# EasyEDA schematic SCH_OPLL-AMP-FMPAC-5V_2023-11-02.json

## Sheets
1 AMP: TITLE: Sheet_1; REV: 1.0; Date: 2023-11-02; Sheet: 1/1; Drawn By: Denjhang; Company: Your Company
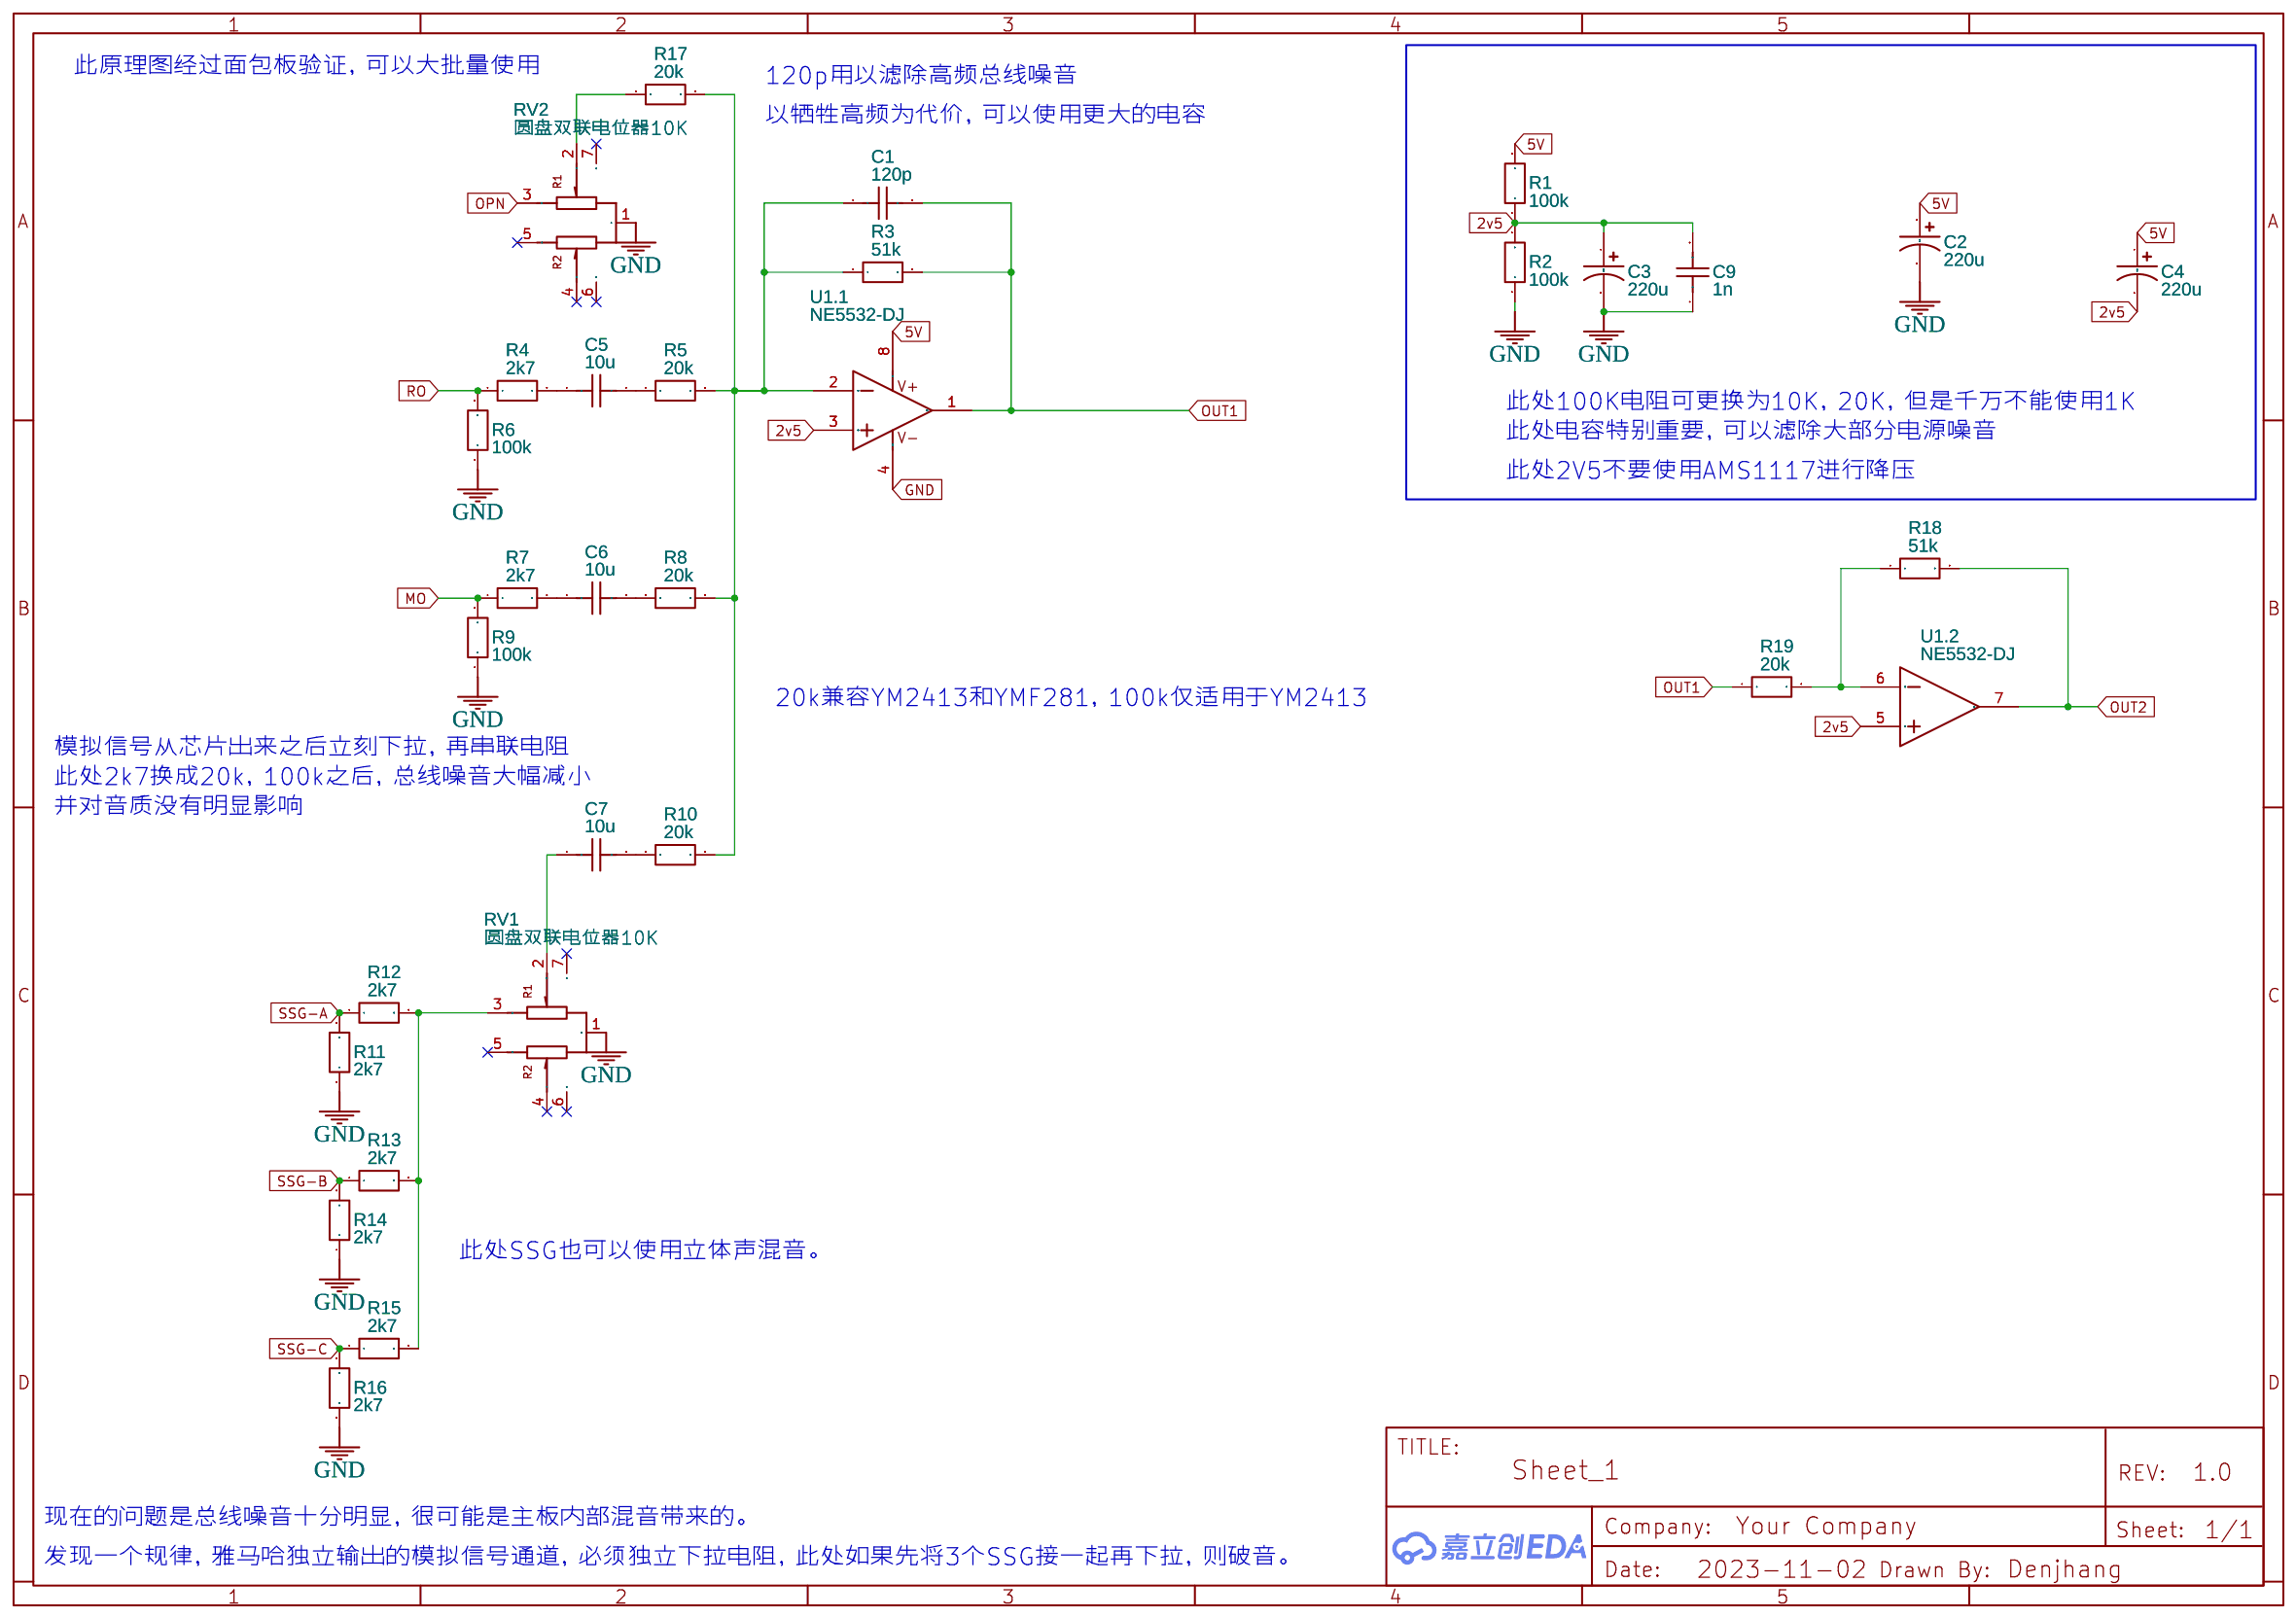
[diagram p0: AMP]
2 BUS: TITLE: Sheet_2
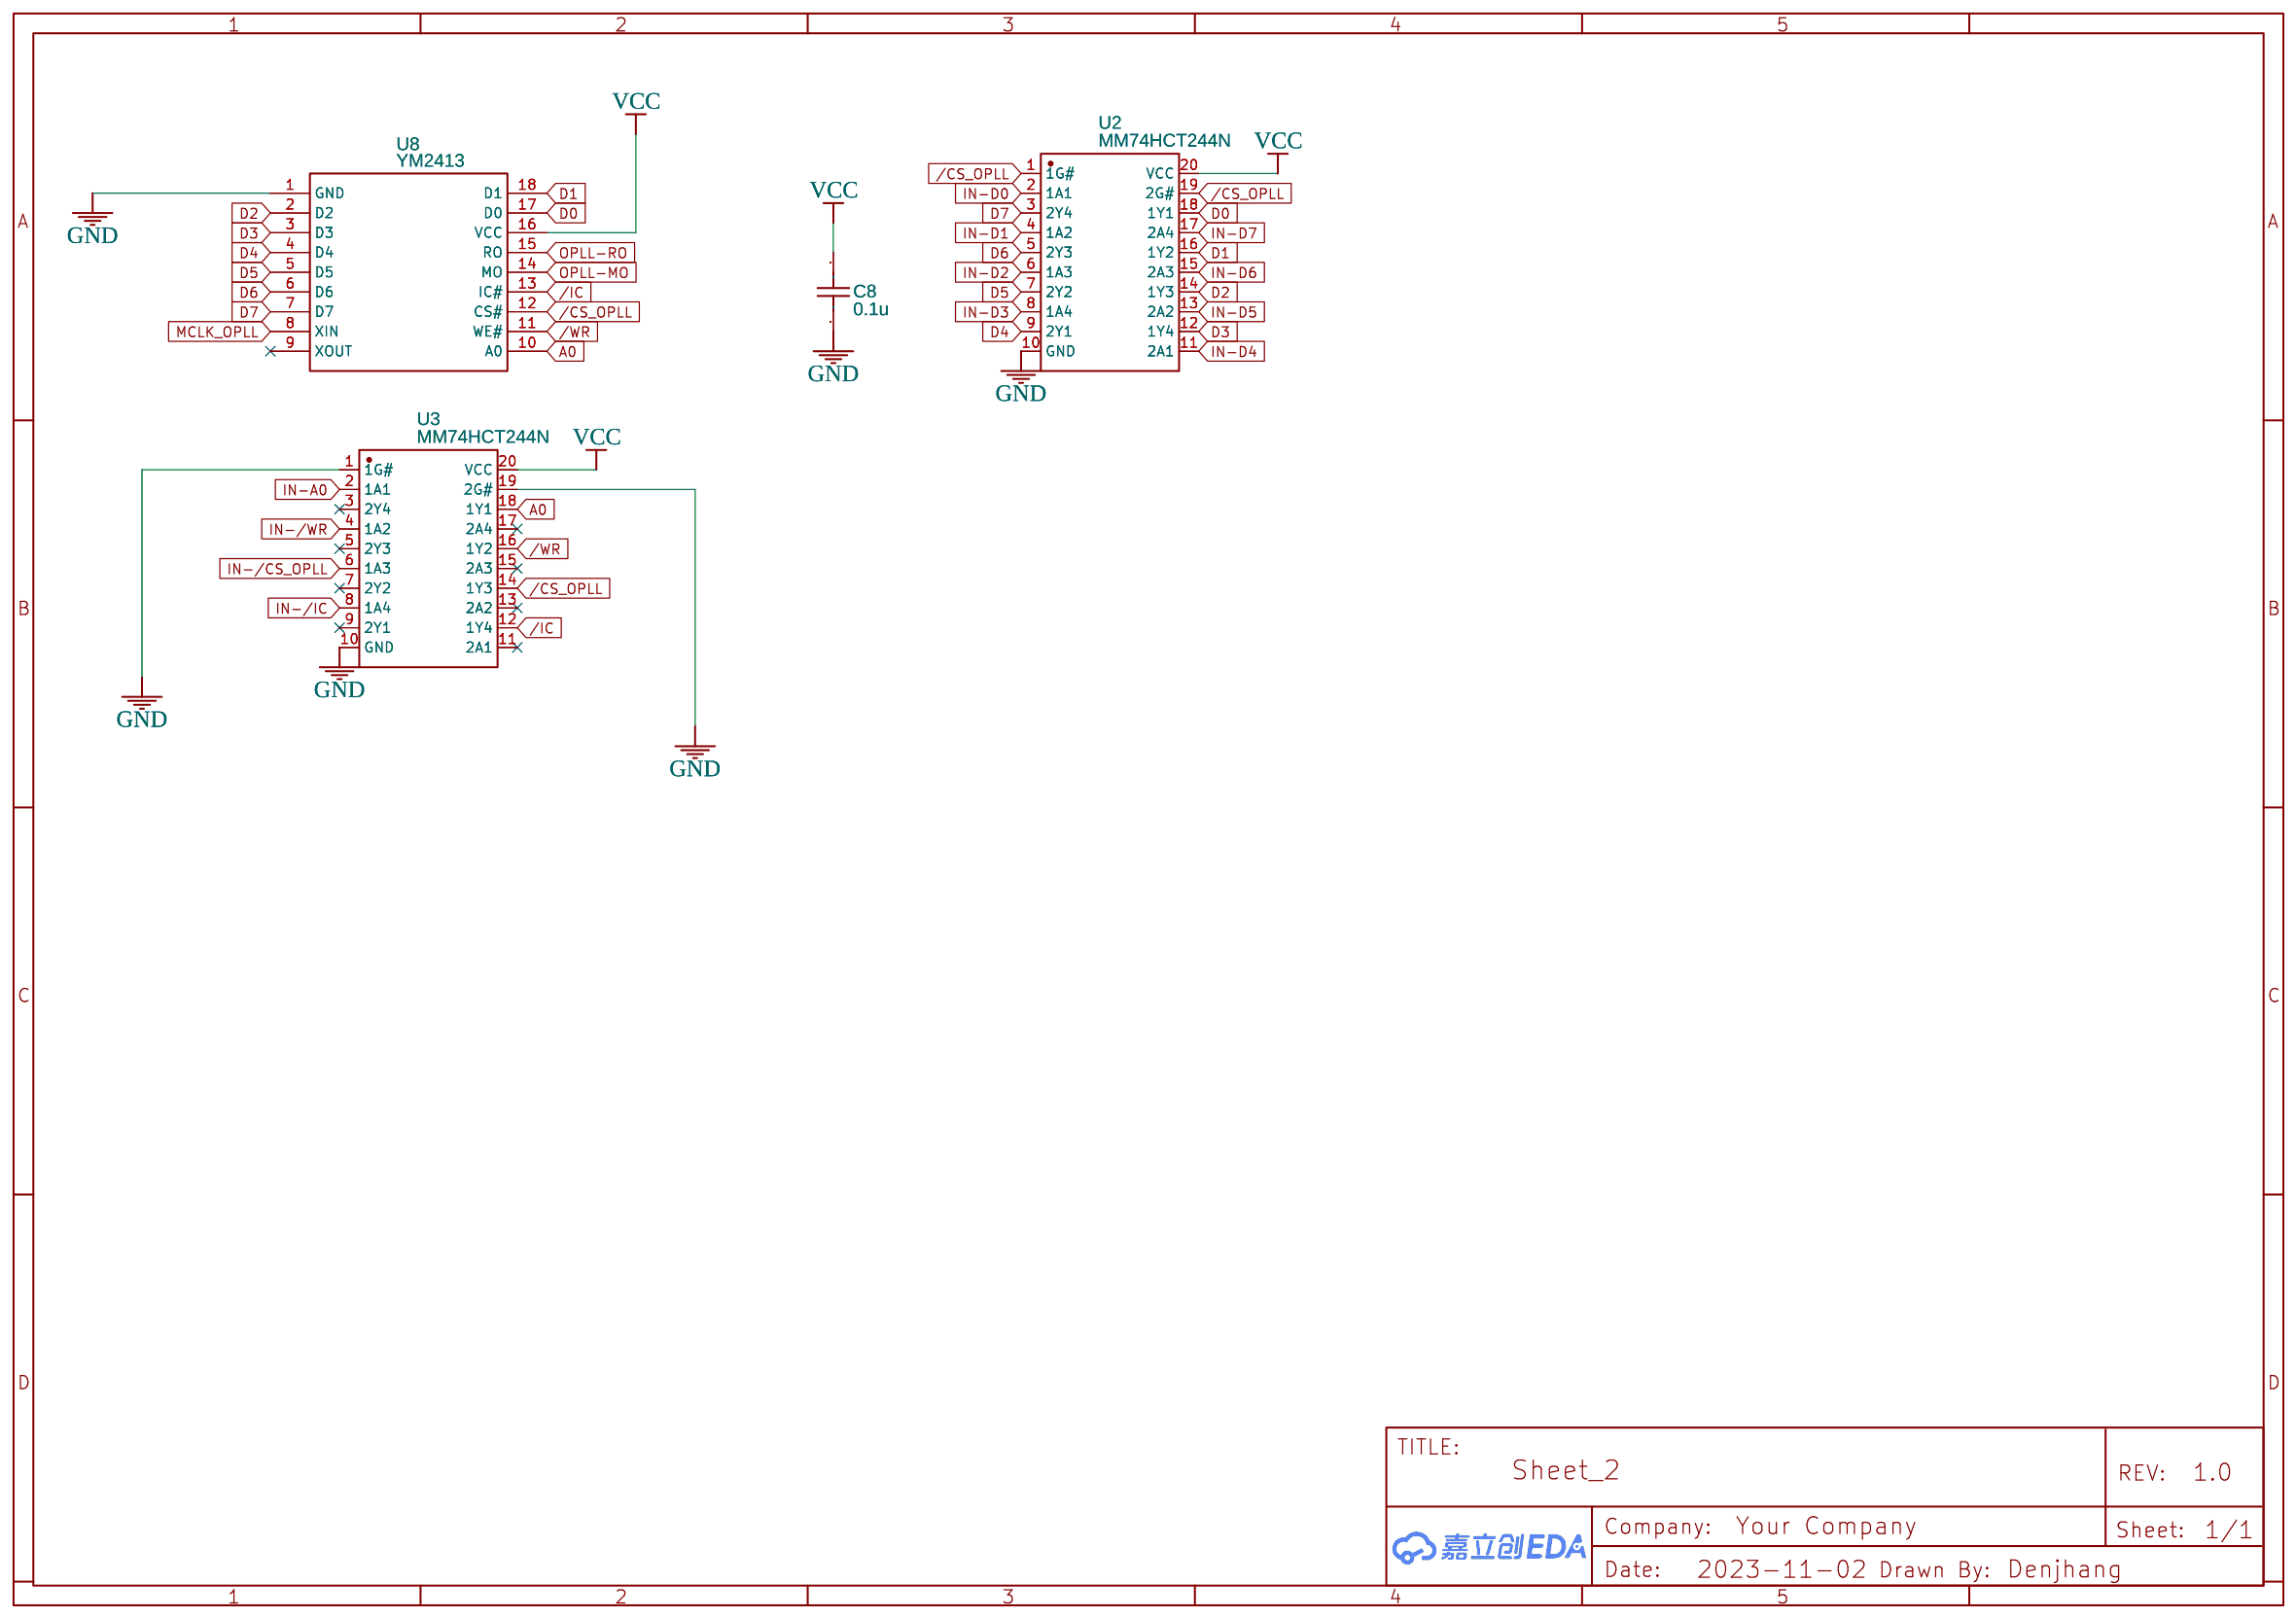
[diagram p1: BUS]

## Parts
sheet AMP
C1  120p  [C0603]
C2  220u  [CAP-D5.0×F2.0]
C3  220u  [CAP-D5.0×F2.0]
C4  220u  [CAP-D5.0×F2.0]
C5  10u  [C0603]
C6  10u  [C0603]
C7  10u  [C0603]
C9  1n  [C0603]
R1  100k  [R0603]
R2  100k  [R0603]
R3  51k  [R0603]
R4  2k7  [R0603]
R5  20k  [R0603]
R6  100k  [R0603]
R7  2k7  [R0603]
R8  20k  [R0603]
R9  100k  [R0603]
R10  20k  [R0603]
R11  2k7  [R0603]
R12  2k7  [R0603]
R13  2k7  [R0603]
R14  2k7  [R0603]
R15  2k7  [R0603]
R16  2k7  [R0603]
R17  20k  [R0603]
R18  51k  [R0603]
R19  20k  [R0603]
RV1  圆盘双联电位器10K  [RES-TH_RK10J12E002L]
RV2  圆盘双联电位器10K  [RES-TH_RK10J12E002L]
U1  NE5532-DJ  [DIP-8-DJ]  (sections 1,2)
sheet BUS
C8  0.1u  [C0603]
U2  MM74HCT244N  [PDIP-20_L25.9-W6.6-P2.54-LS7.9-BL]
U3  MM74HCT244N  [PDIP-20_L25.9-W6.6-P2.54-LS7.9-BL]
U8  YM2413  [DIP-18_方孔IC插座]

## Library data of the parts
C1 C5-C9 = C_0603_US: Contributor: LCEDA_Lib
C2-C4 = CE_TH_D5.0×F2.0_US: Contributor: LCEDA_Lib
R1-R19 = R_0603_EU: Contributor: LCEDA_Lib
RV1 RV2 = 圆盘双联电位器: Contributor: Denjhang
U1 = NE5532-DJ: tags: Audio Operational Amplifier; Supplier Part: C5326; Supplier: LCSC; Manufacturer: TI; Manufacturer Part: NE5532P; subpart_no: 1; image: http://image.lceda.cn/szlcsc/C5326.jpg; JLCPCB Part Class: Extended Part; Contributor: Denjhang
U2 U3 = MM74HCT244N: Contributor: lcsc; Supplier: LCSC; Supplier Part: C3755570; Manufacturer: onsemi(安森美); link: https://so.szlcsc.com/global.html?k=C3755570&ref=editor
U8 = YM2413: Contributor: denjhang

## Nets
2v5: C3.1 C4.2 C9.2 R1.1 R2.2 U1.3(IN1+) U1.5(IN2+)
5V: C2.1 C4.1 R1.2 U1.8(VCC+)
GND: C2.2 C3.2 C8.2 C9.1 R2.1 R6.1 R9.1 R11.1 R14.1 R16.1 RV1.1 RV2.1 U1.4(VCC-) U2.10(GND) U3.1(1G#) U3.10(GND) U3.19(2G#) U8.1(GND)
VCC: C8.1 U2.20(VCC) U3.20(VCC) U8.16(VCC)
/CS_OPLL: U2.1(1G#) U2.19(2G#) U3.14(1Y3) U8.12(CS#)
/IC: U3.12(1Y4) U8.13(IC#)
/WR: U3.16(1Y2) U8.11(WE#)
A0: U3.18(1Y1) U8.10(A0)
D0: U2.18(1Y1) U8.17(D0)
D1: U2.16(1Y2) U8.18(D1)
D2: U2.14(1Y3) U8.2(D2)
D3: U2.12(1Y4) U8.3(D3)
D4: U2.9(2Y1) U8.4(D4)
D5: U2.7(2Y2) U8.5(D5)
D6: U2.5(2Y3) U8.6(D6)
D7: U2.3(2Y4) U8.7(D7)
IN-/CS_OPLL: U3.6(1A3)
IN-/IC: U3.8(1A4)
IN-/WR: U3.4(1A2)
IN-A0: U3.2(1A1)
IN-D0: U2.2(1A1)
IN-D1: U2.4(1A2)
IN-D2: U2.6(1A3)
IN-D3: U2.8(1A4)
IN-D4: U2.11(2A1)
IN-D5: U2.13(2A2)
IN-D6: U2.15(2A3)
IN-D7: U2.17(2A4)
MCLK_OPLL: U8.8(XIN)
MO: R7.1 R9.2
OPLL-MO: U8.14(MO)
OPLL-RO: U8.15(RO)
OPN: RV2.3
OUT1: C1.2 R3.2 R19.1 U1.1(OUT1)
OUT2: R18.2 U1.7(OUT2)
RO: R4.1 R6.2
SSG-A: R11.2 R12.1
SSG-B: R13.1 R14.2
SSG-C: R15.1 R16.2
Net-(C1-1): C1.1 R3.1 R5.2 R8.2 R10.2 R17.2 U1.2(IN1-)
Net-(C5-1): C5.1 R4.2
Net-(C5-2): C5.2 R5.1
Net-(C6-1): C6.1 R7.2
Net-(C6-2): C6.2 R8.1
Net-(C7-1): C7.1 RV1.2
Net-(C7-2): C7.2 R10.1
Net-(R12-2): R12.2 R13.2 R15.2 RV1.3
Net-(R17-1): R17.1 RV2.2
Net-(R18-1): R18.1 R19.2 U1.6(IN2-)

Not connected (* = marked no-connect by the designer): RV1 4* 5* 6(EH)* 7(EH)*; RV2 4* 5* 6(EH)* 7(EH)*; U3 3(2Y4)* 5(2Y3)* 7(2Y2)* 9(2Y1)* 11(2A1)* 13(2A2)* 15(2A3)* 17(2A4)*; U8 9(XOUT)*

## Notes on the sheets
sheet 1
- 此原理图经过面包板验证，可以大批量使用
- 120p用以滤除高频总线噪音
- 以牺牲高频为代价，可以使用更大的电容
- 此处100K电阻可更换为10K，20K，但是千万不能使用1K
- 此处电容特别重要，可以滤除大部分电源噪音
- 此处2V5不要使用AMS1117进行降压
- 20k兼容YM2413和YMF281，100k仅适用于YM2413
- 模拟信号从芯片出来之后立刻下拉，再串联电阻
- 此处2k7换成20k，100k之后，总线噪音大幅减小
- 并对音质没有明显影响
- 此处SSG也可以使用立体声混音。
- 现在的问题是总线噪音十分明显，很可能是主板内部混音带来的。
- 发现一个规律，雅马哈独立输出的模拟信号通道，必须独立下拉电阻，此处如果先将3个SSG接一起再下拉，则破音。
